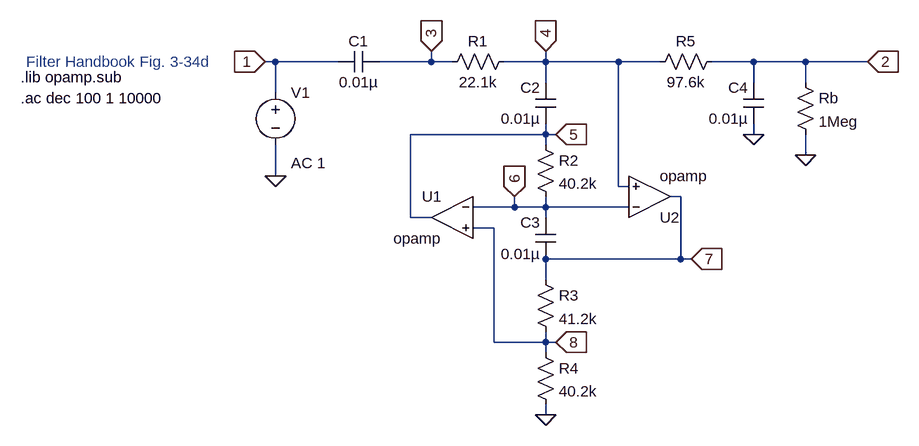
[diagram p0: schematic GIC-LP-Filter.asc]
GIC-LP-Filter.asc, the LTspice schematic file:
Version 4
SHEET 1 880 792
WIRE -368 128 -384 128
WIRE -272 128 -368 128
WIRE -128 128 -128 112
WIRE -128 128 -208 128
WIRE -96 128 -128 128
WIRE 48 128 48 112
WIRE 48 128 -16 128
WIRE 160 128 48 128
WIRE 224 128 160 128
WIRE 368 128 304 128
WIRE 448 128 368 128
WIRE 544 128 448 128
WIRE 48 160 48 128
WIRE 368 160 368 128
WIRE 448 160 448 128
WIRE -368 176 -368 128
WIRE 48 240 48 224
WIRE 48 240 -160 240
WIRE 64 240 48 240
WIRE 368 240 368 224
WIRE 48 256 48 240
WIRE 448 272 448 240
WIRE -368 304 -368 256
WIRE 160 320 160 128
WIRE 176 320 160 320
WIRE 256 336 240 336
WIRE 0 352 0 336
WIRE 0 352 -64 352
WIRE 48 352 48 336
WIRE 48 352 0 352
WIRE 176 352 48 352
WIRE -160 368 -160 240
WIRE -128 368 -160 368
WIRE 48 368 48 352
WIRE -32 384 -64 384
WIRE 256 432 256 336
WIRE 256 432 48 432
WIRE 272 432 256 432
WIRE 48 464 48 432
WIRE -32 560 -32 384
WIRE 48 560 48 544
WIRE 48 560 -32 560
WIRE 64 560 48 560
WIRE 48 576 48 560
WIRE 48 672 48 656
FLAG 48 672 0
FLAG -368 304 0
FLAG 368 240 0
FLAG -384 128 1
IOPIN -384 128 In
FLAG 544 128 2
IOPIN 544 128 In
FLAG 48 112 4
IOPIN 48 112 In
FLAG 64 240 5
IOPIN 64 240 In
FLAG 0 336 6
IOPIN 0 336 In
FLAG 272 432 7
IOPIN 272 432 In
FLAG 64 560 8
IOPIN 64 560 In
FLAG -128 112 3
IOPIN -128 112 In
FLAG 448 272 0
SYMBOL OpAmps\\opamp 208 400 M180
SYMATTR InstName U2
SYMBOL voltage -368 160 R0
WINDOW 123 24 124 Left 2
WINDOW 39 0 0 Left 0
SYMATTR Value2 AC 1
SYMATTR InstName V1
SYMATTR Value ""
SYMBOL OpAmps\\opamp -96 304 M0
SYMATTR InstName U1
SYMBOL cap -208 112 R90
WINDOW 0 0 32 VBottom 2
WINDOW 3 32 32 VTop 2
SYMATTR InstName C1
SYMATTR Value 0.01µ
SYMBOL cap 64 224 R180
WINDOW 0 24 56 Left 2
WINDOW 3 24 8 Left 2
SYMATTR InstName C2
SYMATTR Value 0.01µ
SYMBOL cap 64 432 R180
WINDOW 0 24 56 Left 2
WINDOW 3 24 8 Left 2
SYMATTR InstName C3
SYMATTR Value 0.01µ
SYMBOL cap 384 224 R180
WINDOW 0 24 56 Left 2
WINDOW 3 24 8 Left 2
SYMATTR InstName C4
SYMATTR Value 0.01µ
SYMBOL res 32 240 R0
SYMATTR InstName R2
SYMATTR Value 40.2k
SYMBOL res 32 448 R0
SYMATTR InstName R3
SYMATTR Value 41.2k
SYMBOL res 32 560 R0
SYMATTR InstName R4
SYMATTR Value 40.2k
SYMBOL res 0 112 R90
WINDOW 0 0 56 VBottom 2
WINDOW 3 32 56 VTop 2
SYMATTR InstName R1
SYMATTR Value 22.1k
SYMBOL res 320 112 R90
WINDOW 0 0 56 VBottom 2
WINDOW 3 32 56 VTop 2
SYMATTR InstName R5
SYMATTR Value 97.6k
SYMBOL res 432 144 R0
SYMATTR InstName Rb
SYMATTR Value 1Meg
TEXT -760 152 Left 2 !.lib opamp.sub
TEXT -752 128 Left 2 ;Filter Handbook Fig. 3-34d
TEXT -760 184 Left 2 !.ac dec 100 1 10000

The netlist it stands for:
* GIC-LP-Filter.asc
XU2 6 4 7 opamp Aol=100K GBW=10Meg  ; pins invin noninvin out
V1 1 0 AC 1
XU1 6 8 5 opamp Aol=100K GBW=10Meg  ; pins invin noninvin out
C1 3 1 0.01µ
C2 5 4 0.01µ
C3 7 6 0.01µ
C4 0 2 0.01µ
R2 5 6 40.2k
R3 7 8 41.2k
R4 8 0 40.2k
R1 4 3 22.1k
R5 2 4 97.6k
Rb 2 0 1Meg
.lib opamp.sub
* Filter Handbook Fig. 3-34d
.ac dec 100 1 10000
.backanno
.end